# Altium project BTL_PCB.PrjPcb
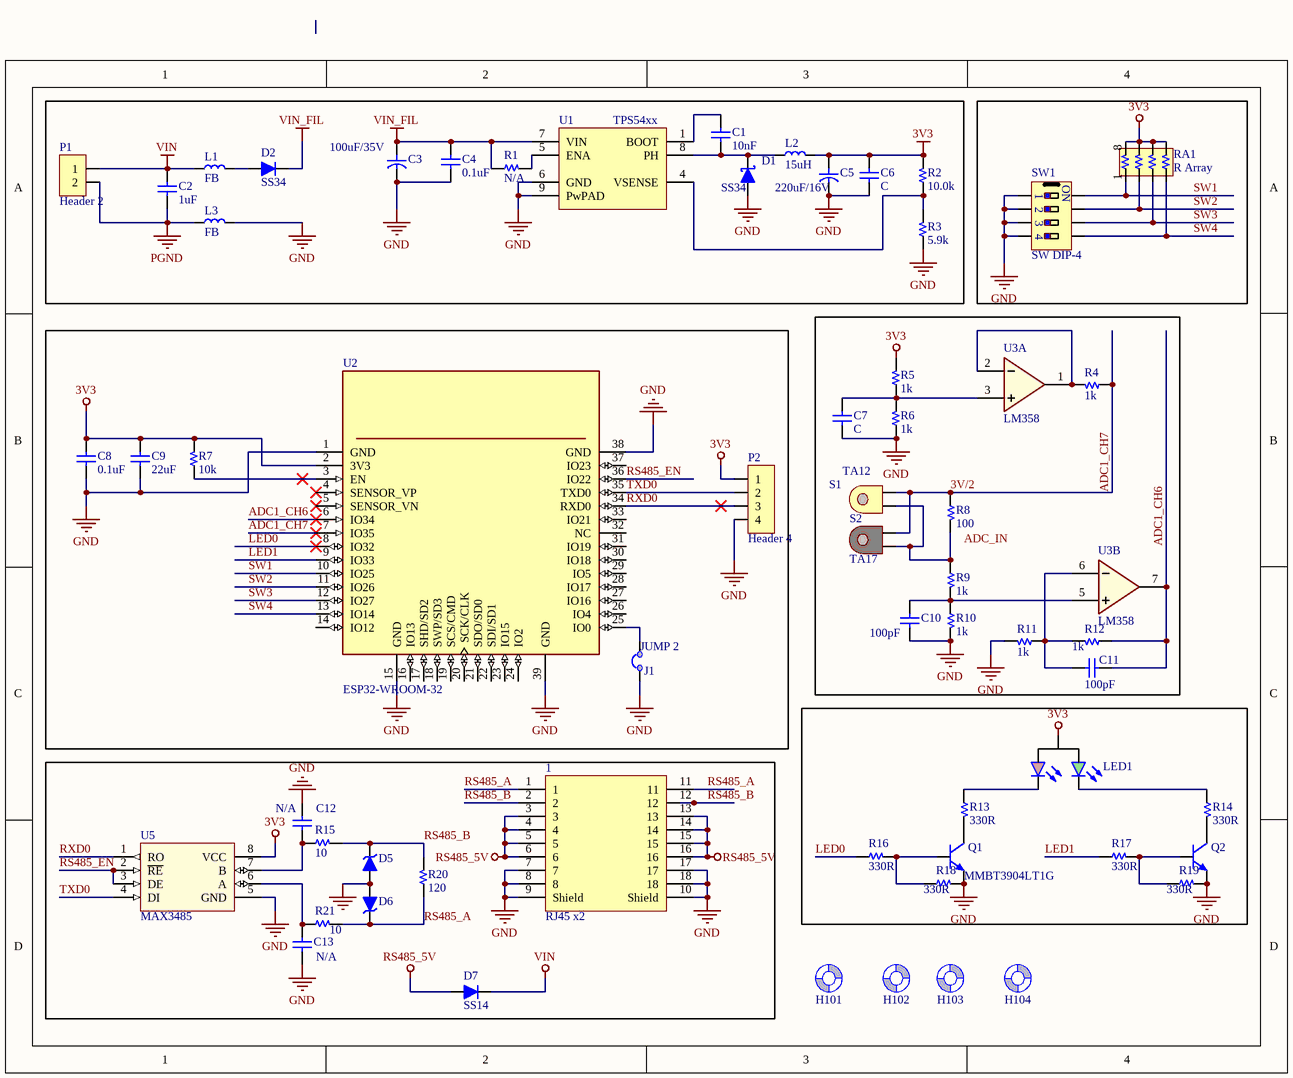
[diagram p0: SCHE_1.SchDoc]
1 sheet, 61 parts. Net scope: global (net labels, ports and power ports of the same name join across sheets).
Board file: PCB1.PcbDoc

## Sheet SCHE_1.SchDoc
size A; SheetNumber: 1; SheetTotal: 1

### Parts
1  RJ45 x2  [CONN/RJ45/x2]
C1  10nF  [C 0805]
C2  1uF  [C 0805]
C3  100uF/35V  [C SMD ALU (D8)]
C4  0.1uF  [C 0805]
C5  220uF/16V  [C SMD ALU (D8)]
C6  C  [C 0805]
C7  C  [C 0805]
C8  0.1uF  [C 0805]
C9  22uF  [C 0805]
C10  100pF  [C 0805]
C11  100pF  [C 0805]
C12  N/A  [C 0805]
C13  N/A  [C 0805]
D1  SS34  [DO-214AC (SMA)]
D2  SS34  [DO-214AC (SMA) L]
D5  (no value)  [DO-214AC (SMA)]
D6  Diode Zener  [DO-214AC (SMA)]  (value not drawn)
D7  SS14  [DO-214AC (SMA)]
H101  Screw Hole  [SCREW/3.2/7.0/M]  (value not drawn)  (no BOM)
H102  Screw Hole  [SCREW/3.2/7.0/M]  (value not drawn)  (no BOM)
H103  Screw Hole  [SCREW/3.2/7.0/M]  (value not drawn)  (no BOM)
H104  Screw Hole  [SCREW/3.2/7.0/M]  (value not drawn)  (no BOM)
J1  JUMP 2  [JUMP/2/Close]  (no BOM)
L1  FB  [L 0805 (2012)]
L2  15uH  [IND_MWSA0518_525418]
L3  FB  [L 0805 (2012)]
LED1  Led 3pin 2color  [LED 3PIN 2COLOR 5MM]  (value not drawn)
P1  Header 2  [HDR/Header/2/BOX]
P2  Header 4  [HDR/Header/4]
Q1  MMBT3904LT1G  [SOT-23]
Q2  MMBT3904LT1G  [SOT-23]  (value not drawn)
R1  N/A  [R 0805]
R2  10.0k  [R 0805]
R3  5.9k  [R 0805]
R4  1k  [R 0805]
R5  1k  [R 0805]
R6  1k  [R 0805]
R7  10k  [R 0805]
R8  100  [R 0805]
R9  1k  [R 0805]
R10  1k  [R 0805]
R11  1k  [R 0805]
R12  1k  [R 0805]
R13  330R  [R 0805]
R14  330R  [R 0805]
R15  10  [R 0805]
R16  330R  [R 0805]
R17  330R  [R 0805]
R18  330R  [R 0805]
R19  330R  [R 0805]
R20  120  [R 0805]
R21  10  [R 0805]
RA1  R Array  [RA4 1206 (3216)]
S1  TA12  [TA12]
S2  TA17  [TA17]
SW1  SW DIP-4  [SW/DIP4]
U1  TPS54xx  [SOIC-8 EP]
U2  ESP32-WROOM-32  [MODULE_ESP32-WROOM-32]
U3  LM358  [SOIC-8]  (parts A,B of 2)
U5  MAX3485  [SOIC-8]

### Nets
3V3: C5.1 C6.1 C8.1 C9.1 L2.2 LED1.2(A) P2.1 R2.2 R5.2 R7.2 RA1.5 RA1.6 RA1.7 RA1.8 U2.2(3V3) U5.8(VCC)
GND: 1.7 1.8 1.9(Shield) 1.10(Shield) 1.17 1.18 C3.2 C4.2 C5.2 C6.2 C7.2 C8.2 C9.2 C10.2 C12.1 C13.2 D1.1(A) D5.1(A) D6.1(A) J1.1 L3.2 P2.4 Q1.2(E) Q2.2(E) R3.1 R6.1 R10.2 R11.2 R18.2 R19.2 SW1.1 SW1.2 SW1.3 SW1.4 U1.6(GND) U1.9(PwPAD) U2.1(GND) U2.15(GND) U2.38(GND) U2.39(GND) U3.4(GND) U5.5(GND)
PGND: C2.2 L3.1 P1.2
RS485_5V: 1.3 1.4 1.5 1.6 1.13 1.14 1.15 1.16 D7.1(A)
VCC: U3.8(VCC)
VIN: C2.1 D7.2(K) L1.1 P1.1
VIN_FIL: C3.1 C4.1 D2.2(K) R1.1 U1.7(VIN)
ADC1_CH6: C11.2 R12.1 U2.6(IO34) U3.7(OutB)
ADC1_CH7: R4.1 R8.1 S1.2 S2.2 U2.7(IO35)
LED0: R16.1 U2.8(IO32)
LED1: R17.1 U2.9(IO33)
RS485_A: 1.1 1.11 D6.2(K) R20.1 R21.2
RS485_B: 1.2 1.12 D5.2(K) R15.2 R20.2
RS485_EN: U2.36(IO22) U5.2(~{RE}) U5.3(DE)
RXD0: P2.3 U2.34(RXD0) U5.1(RO)
SW1: RA1.1 SW1.8 U2.10(IO25)
SW2: RA1.2 SW1.7 U2.11(IO26)
SW3: RA1.3 SW1.6 U2.12(IO27)
SW4: RA1.4 SW1.5 U2.13(IO14)
TXD0: P2.2 U2.35(TXD0) U5.4(DI)
NetC1_1: C1.1 U1.1(BOOT)
NetC1_2: C1.2 D1.2(K) L2.1 U1.8(PH)
NetC7_1: C7.1 R5.1 R6.2 U3.3(A+)
NetC10_1: C10.1 R9.2 R10.1 U3.5(B+)
NetC11_1: C11.1 R11.1 R12.2 U3.6(B-)
NetC12_2: C12.2 R15.1 U5.7(B)
NetC13_1: C13.1 R21.1 U5.6(A)
NetD2_1: D2.1(A) L1.2
NetJ1_2: J1.2 U2.25(IO0)
NetLED1_1: LED1.1(RK) R13.1
NetLED1_3: LED1.3(YK) R14.1
NetQ1_1: Q1.1(B) R16.2 R18.1
NetQ1_3: Q1.3(C) R13.2
NetQ2_1: Q2.1(B) R17.2 R19.1
NetQ2_3: Q2.3(C) R14.2
NetR1_2: R1.2 U1.5(ENA)
NetR2_1: R2.1 R3.2 U1.4(VSENSE)
NetR4_2: R4.2 U3.1(OutA) U3.2(A-)
NetR7_1: R7.1 U2.3(EN)
NetR8_2: R8.2 R9.1 S1.1 S2.1

Not connected (* = marked no-connect by the designer): H101 1(Screw); H102 1(Screw); H103 1(Screw); H104 1(Screw); U2 4(SENSOR_VP)* 5(SENSOR_VN)* 14(IO12) 16(IO13) 17(SHD/SD2) 18(SWP/SD3) 19(SCS/CMD) 20(SCK/CLK) 21(SDO/SD0) 22(SDI/SD1) 23(IO15) 24(IO2) 26(IO4) 27(IO16) 28(IO17) 29(IO5) 30(IO18) 31(IO19) 32(NC) 33(IO21) 37(IO23)

### Notes on the sheet
- (near R8) 3V/2
- ADC_IN
- (in symbol SW DIP-4) ON

### Library data of the parts
1 = CON RJ45 x2: Connector RJ45 X2
C1 C2 C4 C6-C13 = Capacitor NP: Capacitor non-pol
C3 C5 = Capacitor: Capacitor pol
D1 = Diode Schottky: Schottky Diode
D2 D7 = Diode: Default Diode
D5 D6 = Diode Zener: Zener Diode
L1-L3 = Inductor
LED1 = Led 3pin 2color: Typical LED 3-pin 2-color
P1 = Header 2: Header, 2-Pin
P2 = Header 4: Header, 4-Pin
Q1 Q2 = Transistor NPN: NPN Bipolar Transistor
R1-R21 = Resistor
RA1 = Resistor Array 4
U1 = TPS54xx: 3/5A, Wide input range, Step-down SWIFT DC-DC Converter
U2 = ESP32-WROOM-32: Bluetooth, WiFi 802.11b/g/n, Bluetooth v4.2 + EDR, Class 1, 2 and 3 Transceiver Module 2.4GHz ~ 2.5GHz Integrated, Trace Surface Mount; MF: Espressif Systems; MP: ESP32-WROOM-32D; Price: None; Package: Module Espressif Systems; Availability: Unavailable; SnapEDA_Link: https://www.snapeda.com/parts/ESP32-WROOM-32D/Espressif%20Systems/view-part/2768115/?ref=snap; Value: *
U3 = LM358: Low Power Dual Operational Amplifiers
U5 = MAX485: Low-Power, Slew-Rate-Limited  RS-485/RS-422 Transceivers
H101-H104 = Screw Hole: TYPE: NO-BOM; UNIT PRICE: 0